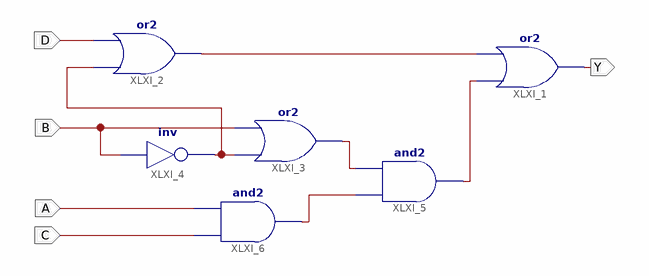
[diagram p0: schematic sheet 1]
// Xilinx ISE schematic Scheme1.sch (artix7) as structural Verilog: 6 symbols, 6 ports
module Scheme1 (
  input  B,
  input  D,
  input  C,
  input  A,
  input  XLXN_48,
  output Y
);

  wire XLXN_11, XLXN_12, XLXN_13, XLXN_15;

  or XLXI_1 (Y, XLXN_13, XLXN_11);
  and XLXI_5 (XLXN_13, XLXN_15, XLXN_12);
  or XLXI_3 (XLXN_12, XLXN_48, B);
  not XLXI_4 (XLXN_48, B);
  or XLXI_2 (XLXN_11, XLXN_48, D);
  and XLXI_6 (XLXN_15, C, A);
endmodule
